# Altium schematic sheet LDO.SchDoc
size A4; SheetNumber: 21; SheetTotal: 36
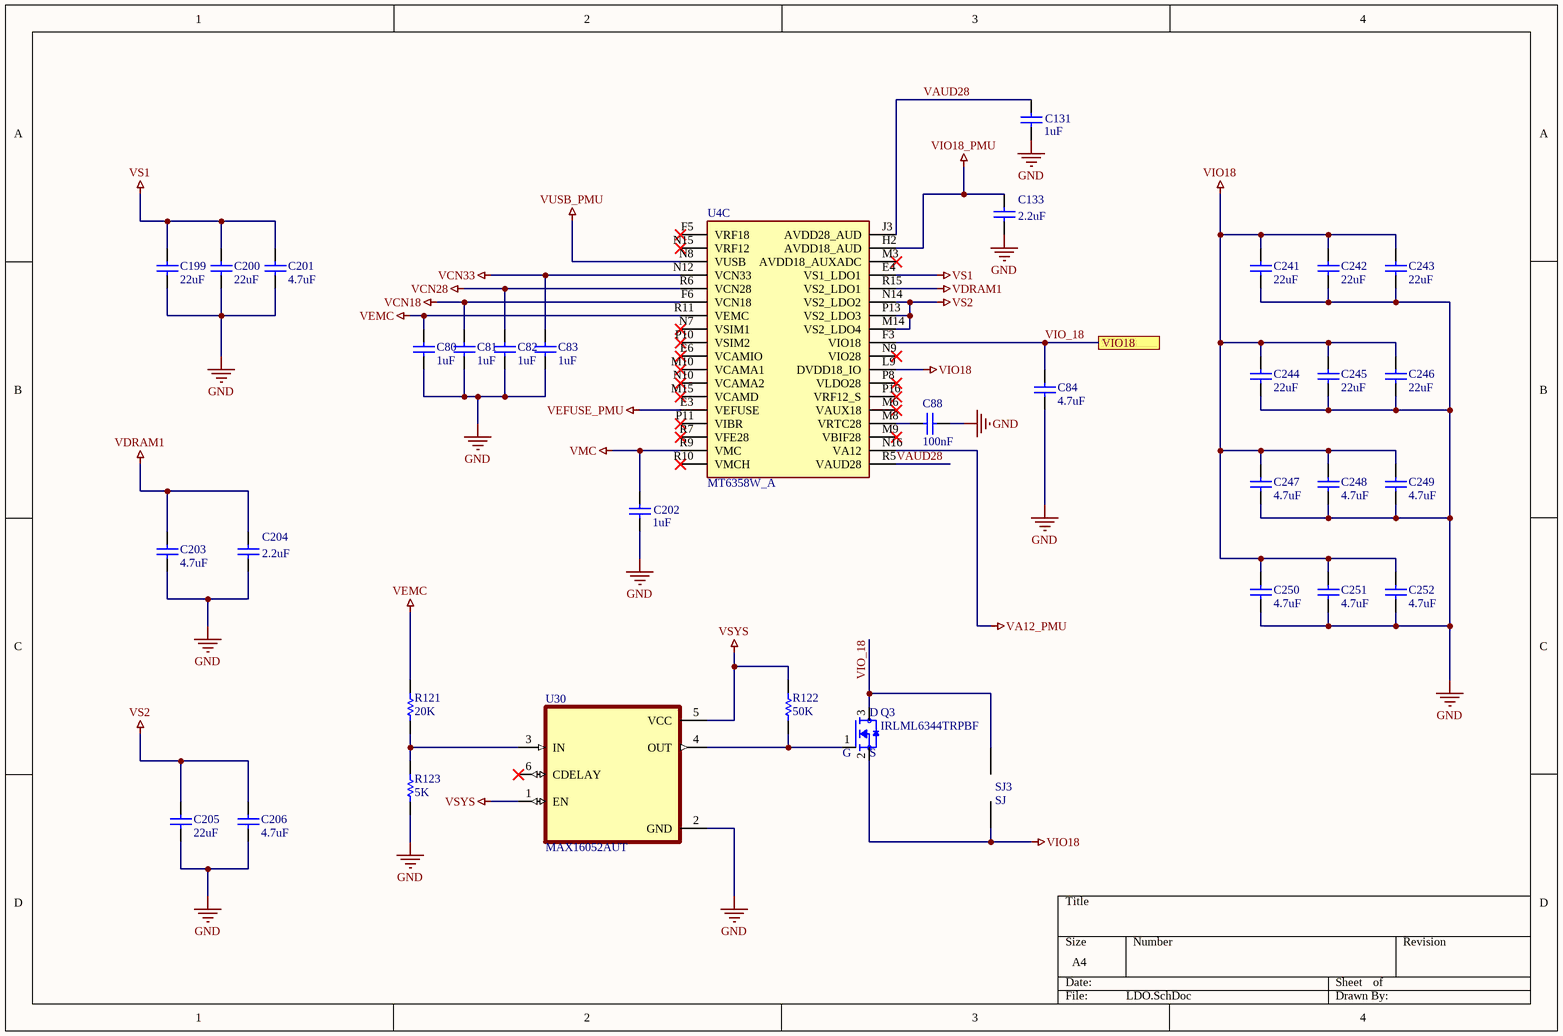
[diagram p0: LDO.SchDoc]

## Parts
C80  value 1uF  [C0805]  (hidden comment: C0805)
C81  value 1uF  [C0805]  (hidden comment: C0805)
C82  value 1uF  [C0805]  (hidden comment: C0805)
C83  value 1uF  [C0805]  (hidden comment: C0805)
C84  value 4.7uF  [C0805]  (hidden comment: C0805)
C88  value 100nF  [C0603]  (hidden comment: C0603)
C131  value 1uF  [C0805]  (hidden comment: C0805)
C133  value 2.2uF  [C0805]  (hidden comment: C0805)
C199  value 22uF  [C1210]  (hidden comment: C1210)
C200  value 22uF  [C1210]  (hidden comment: C1210)
C201  value 4.7uF  [C0805]  (hidden comment: C0805)
C202  value 1uF  [C0805]  (hidden comment: C0805)
C203  value 4.7uF  [C0805]  (hidden comment: C0805)
C204  value 2.2uF  [C0805]  (hidden comment: C0805)
C205  value 22uF  [C1210]  (hidden comment: C1210)
C206  value 4.7uF  [C0805]  (hidden comment: C0805)
C241  value 22uF  [C1210]  (hidden comment: C1210)
C242  value 22uF  [C1210]  (hidden comment: C1210)
C243  value 22uF  [C1210]  (hidden comment: C1210)
C244  value 22uF  [C1210]  (hidden comment: C1210)
C245  value 22uF  [C1210]  (hidden comment: C1210)
C246  value 22uF  [C1210]  (hidden comment: C1210)
C247  value 4.7uF  [C0805]  (hidden comment: C0805)
C248  value 4.7uF  [C0805]  (hidden comment: C0805)
C249  value 4.7uF  [C0805]  (hidden comment: C0805)
C250  value 4.7uF  [C0805]  (hidden comment: C0805)
C251  value 4.7uF  [C0805]  (hidden comment: C0805)
C252  value 4.7uF  [C0805]  (hidden comment: C0805)
Q3  IRLML6344TRPBF  [SOT95P240X112-3N]
R121  value 20K  [R0603]  (hidden comment: R0603)
R122  value 50K  [R0603]  (hidden comment: R0603)
R123  value 5K  [R0603]  (hidden comment: R0603)
SJ3  SJ  [SJ2]
U4  MT6358W_A  [BGA194C40P16X15_640X600X66]  (part C of 6)
U30  MAX16052AUT  [SOT95P280X145-6N]

## Ports
VIO18 (see Power[7500,6000], BUCK[8200,4300])

## Nets
GND: C80.1 C81.1 C82.1 C83.1 C84.1 C88.1 C131.1 C133.1 C199.1 C200.1 C201.1 C202.1 C203.1 C204.1 C205.1 C206.1 C241.1 C242.1 C243.1 C244.1 C245.1 C246.1 C247.1 C248.1 C249.1 C250.1 C251.1 C252.1 R123.1 U30.2(GND)
VA12_PMU: U4.N16(VA12)
VCN18: C81.2 U4.F6(VCN18)
VCN28: C82.2 U4.R6(VCN28)
VCN33: C83.2 U4.N12(VCN33)
VDRAM1: C203.2 C204.2 U4.R15(VS2_LDO1)
VEFUSE_PMU: U4.E3(VEFUSE)
VEMC: C80.2 R121.2 U4.R11(VEMC)
VIO18: C241.2 C242.2 C243.2 C244.2 C245.2 C246.2 C247.2 C248.2 C249.2 C250.2 C251.2 C252.2 Q3.2(S) SJ3.1 U4.L9(DVDD18_IO)
VIO18_PMU: C133.2 U4.H2(AVDD18_AUD)
VMC: C202.2 U4.R9(VMC)
VS1: C199.2 C200.2 C201.2 U4.E4(VS1_LDO1)
VS2: C205.2 C206.2 U4.M14(VS2_LDO4) U4.N14(VS2_LDO2) U4.P13(VS2_LDO3)
VSYS: R122.2 U30.1(EN) U30.5(VCC)
VUSB_PMU: U4.N8(VUSB)
VAUD28: C131.2 U4.J3(AVDD28_AUD) U4.R5(VAUD28)
VIO_18: C84.2 Q3.3(D) SJ3.2 U4.F3(VIO18) ; port VIO18
NetC88_2: C88.2 U4.M8(VRTC28)
NetQ3_1: Q3.1(G) R122.1 U30.4(OUT)
NetR121_1: R121.1 R123.2 U30.3(IN)

Not connected (* = marked no-connect by the designer): U4 E6(VCAMIO)* F5(VRF18)* M3(AVDD18_AUXADC)* M6(VAUX18)* M9(VBIF28)* M10(VCAMA1)* M15(VCAMD)* N7(VSIM1)* N9(VIO28)* N10(VCAMA2)* N15(VRF12)* P8(VLDO28)* P10(VSIM2)* P11(VIBR)* P16(VRF12_S)* R7(VFE28)* R10(VMCH)*; U30 6(CDELAY)*

## Library data of the parts
Q3 = IRLML6344TRPBF: IRLML6344TRPBF N-channel MOSFET Transistor, 5 A, 30 V, 3-Pin SOT-23 | Infineon IRLML6344TRPBF
SJ3 = SJ: Để hở. hàn 2 đầu lại nếu cần
U4 = MT6358W_A: PMIC; Manufacturer_Name: Mediatek; Manufacturer_Part_Number: MT6358W/A; Datasheet Link: https://www.mouser.com/catalog/specsheets/MediaTek_MTK_MT6358_Product_Brief_v1_0.pdf?_gl=1*14yevt7*_ga*OTAyMjU2NDU3LjE2ODExMDUyMzk.*_ga_1KQLCYKRX3*MTcwODA1NjU3MS4xMTcuMC4xNzA4MDU2NTczLjAuMC4w*_ga_15W4STQT4T*MTcwODA1NjU3Mi4xNzIuMC4xNzA4MDU2NTczLjU5LjAuMA..; Height: 0.66mm; Mouser Part Number: 840-MT6358W/A; Mouser Price/Stock: https://www.mouser.co.uk/ProductDetail/MediaTek/MT6358W-A?qs=Jm2GQyTW%2FbiK3FZkyfX0lQ%3D%3D
U30 = MAX16052AUT: High-Voltage, Adjustable Sequencing/Supervisory Circuitss